# EAGLE design Venti rev1 (EAGLE 7.2.0)
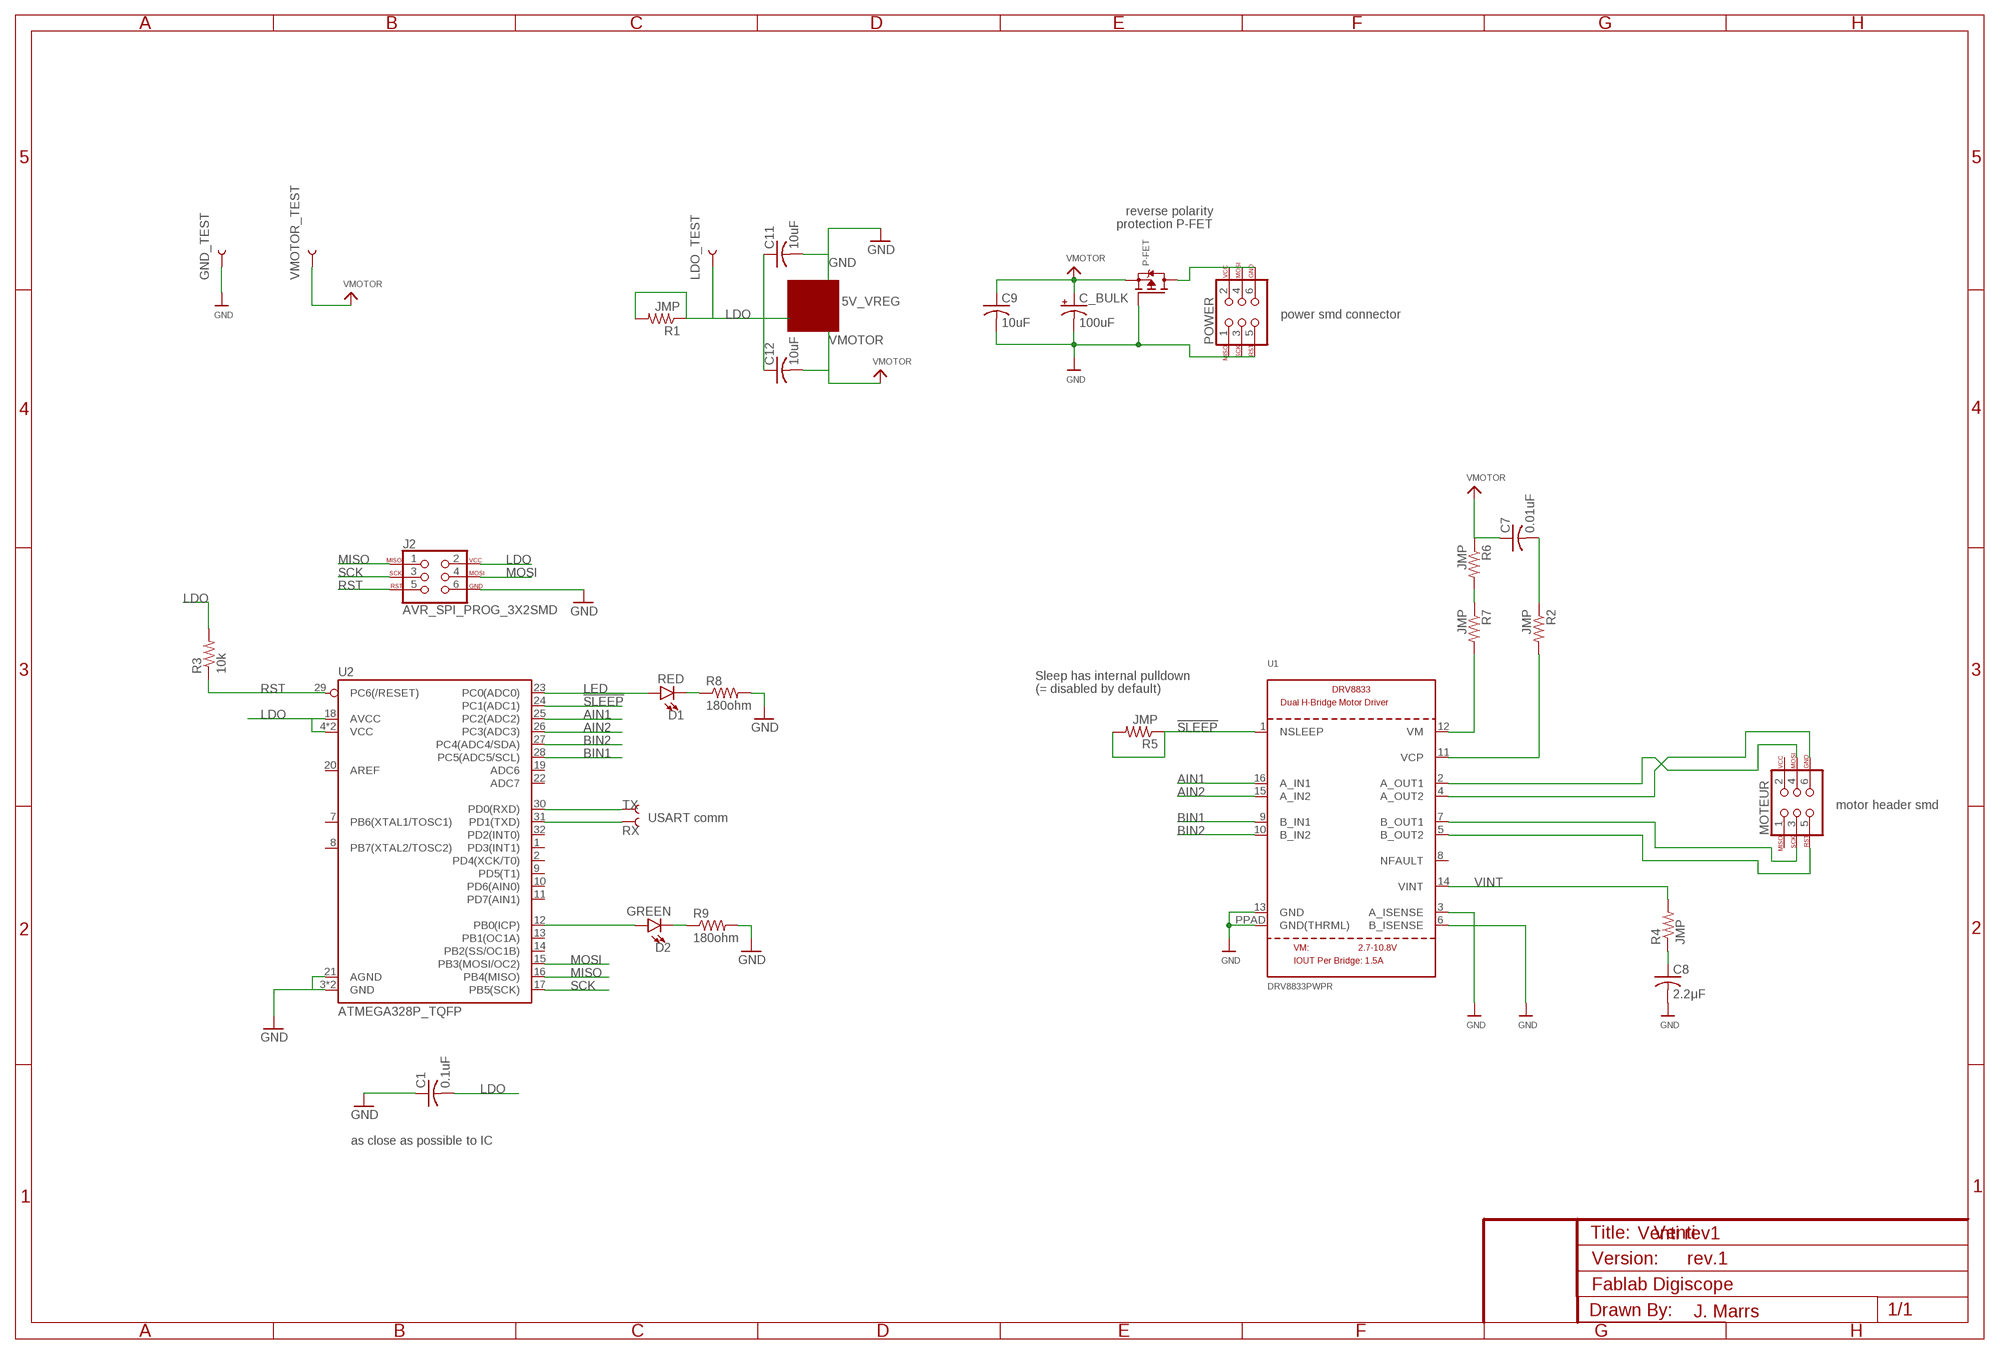
[diagram p0: schematic, sheet 1]

## Parts
5V_VREG  MOSFET_PCH-DMG2305UX-7  [SOT23-3]
C1  0.1uF  C-USC1206  [C1206]
C7  0.01uF  C-USC1206  [C1206]
C8  2.2μF  C-USC1206  [C1206]
C9  10uF  C-USC1206  [C1206]
C11  10uF  C-USC1206  [C1206]
C12  10uF  C-USC1206  [C1206]
C_BULK  100uF  100UF-POLAR-RADIAL-2.5MM-25V-20%  [CPOL-RADIAL-2.5MM-6.5MM]
D1  RED  LED-RED1206  [LED-1206]
D2  GREEN  LED-RED1206  [LED-1206]
GND_TEST  TEST-POINT3  [PAD.03X.03]
J2  AVR_SPI_PROG_3X2SMD  [2X3_SMT_POSTS]
LDO_TEST  TEST-POINT3  [PAD.03X.03]
MOTEUR  AVR_SPI_PROG_3X2SMD  [2X3_SMT_POSTS]
P-FET  MOSFET-PWIDE  [SOT23-WIDE]
POWER  AVR_SPI_PROG_3X2SMD  [2X3_SMT_POSTS]
R1  JMP  R-US_R1206  [R1206]
R2  JMP  R-US_R1206  [R1206]
R3  10k  R-US_R1206  [R1206]
R4  JMP  R-US_R1206  [R1206]
R5  JMP  R-US_R1206  [R1206]
R6  JMP  R-US_R1206  [R1206]
R7  JMP  R-US_R1206  [R1206]
R8  180ohm  R-US_R1206  [R1206]
R9  180ohm  R-US_R1206  [R1206]
RX  TEST-POINT3  [PAD.03X.03]
TX  TEST-POINT3  [PAD.03X.03]
U1  DRV8833PWPR  DRV8833  [HTSSOP16]
U2  ATMEGA328P_TQFP  [TQFP32-08]
VMOTOR_TEST  TEST-POINT3  [PAD.03X.03]

## Nets
!SLEEP: R5.1 R5.2 U1.1(NSLEEP) U2.24(PC1(ADC1))
AIN1: U1.16(A_IN1) U2.25(PC2(ADC2))
AIN2: U1.15(A_IN2) U2.26(PC3(ADC3))
AOUT1: MOTEUR.4 U1.2(A_OUT1)
AOUT2: MOTEUR.6 U1.4(A_OUT2)
BIN1: U1.9(B_IN1) U2.28(PC5(ADC5/SCL))
BIN2: U1.10(B_IN2) U2.27(PC4(ADC4/SDA))
BOUT1: MOTEUR.3 U1.7(B_OUT1)
BOUT2: MOTEUR.5 U1.5(B_OUT2)
GND: 5V_VREG.3(D) C1.1 C8.2 C9.2 C11.2 C_BULK.2(-) GND_TEST.P$1 J2.6 P-FET.1(G) POWER.1 POWER.3 POWER.5 R8.2 R9.2 U1.3(A_ISENSE) U1.6(B_ISENSE) U1.13(GND) U1.PPAD(GND(THRML)) U2.3(GND) U2.5(GND) U2.21(AGND)
LDO: 5V_VREG.1(G) C1.2 C11.1 C12.1 J2.2 LDO_TEST.P$1 R1.1 R1.2 R3.2 U2.4(VCC) U2.6(VCC) U2.18(AVCC)
LED: D1.A U2.23(PC0(ADC0))
MISO: J2.1 U2.16(PB4(MISO))
MOSI: J2.4 U2.15(PB3(MOSI/OC2))
N$1: C8.1 R4.1
N$2: C7.2 R2.1
N$4: R7.2 U1.12(VM)
N$5: R6.2 R7.1
N$6: TX.P$1 U2.30(PD0(RXD))
N$7: RX.P$1 U2.31(PD1(TXD))
N$8: R2.2 U1.11(VCP)
N$9: D2.A U2.12(PB0(ICP))
N$10: D1.C R8.1
N$11: D2.C R9.1
PWRIN: P-FET.3(D) POWER.2 POWER.4 POWER.6
RST: J2.5 R3.1 U2.29(PC6(/RESET))
SCK: J2.3 U2.17(PB5(SCK))
VINT: R4.2 U1.14(VINT)
VMOTOR: 5V_VREG.2(S) C7.1 C9.1 C12.2 C_BULK.1(+) P-FET.2(S) R6.1 VMOTOR_TEST.P$1
Unconnected: MOTEUR.1 MOTEUR.2 U1.8(NFAULT) U2.1(PD3(INT1)) U2.2(PD4(XCK/T0)) U2.7(PB6(XTAL1/TOSC1)) U2.8(PB7(XTAL2/TOSC2)) U2.9(PD5(T1)) U2.10(PD6(AIN0)) U2.11(PD7(AIN1)) U2.13(PB1(OC1A)) U2.14(PB2(SS/OC1B)) U2.19(ADC6) U2.20(AREF) U2.22(ADC7) U2.32(PD2(INT0))

## Notes on the sheet
- reverse polarity
- protection P-FET
- power smd connector
- Sleep has internal pulldown
- (= disabled by default)
- motor header smd
- USART comm
- as close as possible to IC
- Venti
- rev.1
- Fablab Digiscope
- J. Marrs

## Library data of the parts
5V_VREG = SparkFun-DiscreteSemi:MOSFET_PCH: P-channel MOSFETs Voltage controlled devices that allow control of high current outputs. SparkFun Products: SparkFun ESP32 Thing <https://www.sparkfun.com/products/13907> SparkFun ESP8266 Thing <https://www.sparkfun.com/products/13231> SparkFun Pi Servo HAT V2 <https://www.sparkfun.com/products/15316> DMG2305UX-7 (20V/4.2A/SOT23-3); PROD_ID: TRAN-14388; VALUE: 20V/4.2A/52mΩ/1.4W
C1 C7-C9 C11 C12 = adafruit:C-US: CAPACITOR, American symbol
C_BULK = SparkFun-Capacitors:100UF-POLAR: 100µF polarized capacitors A capacitor is a passive two-terminal electrical component used to store electrical energy temporarily in an electric field.; PROD_ID: CAP-08439
D1 = SparkFun-LED:LED-RED: Red SMD LED Used in manufacturing of most products at SparkFun Packages: 0603 - SMD 0603 package [Product Link] <http://docs.avagotech.com/docs/AV02-0551EN> 0603 SMART - SMD 0603 SMART package ( more efficient and expensive)[Product Link] <http://www.osram-os.com/Graphics/XPic2/00077099_0.pdf> 1206 - SMD1206 package [Product Link] <https://www.sparkfun.com/datasheets/DevTools/LilyPad/Q150OVS4.pdff> SparkFun Products: Pro Mini 328 -5V <https://www.sparkfun.com/products/821> RedBoard <https://www.sparkfun.com/products/12757> IOIO-OTG <https://www.sparkfun.com/products/13613>; PROD_ID: DIO-09912
D2 = SparkFun-LED:LED-RED: Red SMD LED Used in manufacturing of most products at SparkFun Packages: 0603 - SMD 0603 package [Product Link] <http://docs.avagotech.com/docs/AV02-0551EN> 0603 SMART - SMD 0603 SMART package ( more efficient and expensive)[Product Link] <http://www.osram-os.com/Graphics/XPic2/00077099_0.pdf> 1206 - SMD1206 package [Product Link] <https://www.sparkfun.com/datasheets/DevTools/LilyPad/Q150OVS4.pdff> SparkFun Products: Pro Mini 328 -5V <https://www.sparkfun.com/products/821> RedBoard <https://www.sparkfun.com/products/12757> IOIO-OTG <https://www.sparkfun.com/products/13613>; PROD_ID: DIO-09912; VALUE: RED
GND_TEST LDO_TEST RX TX VMOTOR_TEST = SparkFun-Connectors:TEST-POINT: SparkFun Test Points Bare copper test points for troubleshooting or In-Circuit-Testing. These are used by our Production team for verifying production board runs using pogo-pins on test beds. SparkFun Products: SparkFun LSM9DS1 Breakout <https://www.sparkfun.com/products/13284> SparkFun PSOC <https://www.sparkfun.com/products/13714> SparkFun Load Cell Amplifier <https://www.sparkfun.com/products/13879>
J2 MOTEUR POWER = SparkFun-Connectors:AVR_SPI_PROG_3X2: AVR ISP 6 Pin This is the reduced ISP connector for AVR programming. Common on Arduino. This footprint will take up less PCB space and can be used with a 10-pin to 6-pin adapter such as SKU: BOB-08508 **Special note about "TEST_POINT" package. The stop mask is on the top side, so if you want your programming test points to be on the bottom of your board, make sure to place this package on the bottom side of the board. This also ensure that the orientation to program from the bottom side will be correct. SparkFun Products: SparkFun ISP Pogo Adapter <https://www.sparkfun.com/products/11591> - NS Tiny AVR Programmer <https://www.sparkfun.com/products/11801> -PTH
P-FET = microbuilder:MOSFET-P: P-Channel Mosfet LEGEND VDS: Voltage Drain-Source ID: Drain Current RDS(ON): Drain-Source On-State Resistance VGS(TH): Gate-Source Threshold Voltage CISS: Drain-Source Input Capacitance SOT-23 Name VDS ID RDS(ON) VGS(TH) CISS Order Number IRLML5103 30V 760mA 600 mOhm -- 75pF @ 25V Digikey: IRLML5103PBFCT-ND IRLML6401 12V 4.3A 50 mOhm 950mV @ 250µA 830pF @ 10V Digikey: IRLML6401PBFTR-ND NTR0202PL 20V 400mA 800 mOhm 2.3V @ 250uA 70pF @ 5V Digikey: NTR0202PLT1GOSTR-ND NTR4101PT1G 20V 1.8A 85 mOhm 1.2V @ 250uA 675pF @ 10V Digikey: NTR4101PT1GOSCT-ND DMP2004K 20V 600mA 900 mOhm 1V @ 250uA 175pF @ 16V Digikey: DMP2004KDICT-ND PMV65XP 20V 3.9A 76 mOhm 950mV @ 1mA 725pF @ 20V Digikey: 568-2358-2-ND TO-252 Name VDS ID RDS(ON) VGS(TH) CISS Order Number AOD417 30V 25A 34 mOhm 3V @ 250µA 920pF @ 15V Digikey: 785-1106-2-ND
R1-R9 = adafruit:R-US_: RESISTOR, American symbol
U1 = microbuilder:DRV8833: DRV8833 Dual H-Bridge Motor Driver -- HTSSOP Package
U2 = SparkFun-IC-Microcontroller:ATMEGA328P_TQFP: Popular 328P in QFP Storefront component: ATmega328 - TQFP <https://www.sparkfun.com/products/13448> (COM-13448) Datasheet <http://www.sparkfun.com/datasheets/Components/SMD/ATMega328.pdf> SparkFun Products SparkFun RedBoard - Programmed with Arduino <https://www.sparkfun.com/products/12757> (DEV-12757) Arduino Pro Mini 328 - 5V/16MHz <https://www.sparkfun.com/products/11113> (DEV-11113) Arduino Pro Mini 328 - 3.3V/8MHz <https://www.sparkfun.com/products/11114> (DEV-11114) SparkFun OpenLog <https://www.sparkfun.com/products/13712> (DEV-13712) SparkFun MicroView - OLED Arduino Module <https://www.sparkfun.com/products/12923> (DEV-12923) SparkFun Digital Sandbox <https://www.sparkfun.com/products/12651> (DEV-12651) SparkFun PicoBoard <https://www.sparkfun.com/products/11888> (WIG-11888) Arduino Fio <https://www.sparkfun.com/products/10116> (DEV-10116) LilyPad Arduino 328 Main Board <https://www.sparkfun.com/products/13342> (DEV-13342) SparkFun RedStick <https://www.sparkfun.com/products/13741> (DEV-13741) LilyPad MP3 <https://www.sparkfun.com/products/11013> (DEV-11013) LilyPad Arduino SimpleSnap <https://www.sparkfun.com/products/10941> (DEV-10941) SparkFun Stepoko <https://www.sparkfun.com/products/13899> (ROB-13899) SparkFun Geiger Counter <https://www.sparkfun.com/products/11345> (SEN-11345) SparkFun EL Sequencer <https://www.sparkfun.com/products/12781> (COM-12781) Arduino Pro 328 - 5V/16MHz <https://www.sparkfun.com/products/10915> (DEV-10915) CryptoCape <https://www.sparkfun.com/products/12773> (DEV-12773) SparkFun IR Thermometer Evaluation Board - MLX90614 <https://www.sparkfun.com/products/10740> (SEN-10740) SparkFun RedBot Mainboard <https://www.sparkfun.com/products/12097> (ROB-12097) Arduino Pro 328 - 3.3V/8MHz <https://www.sparkfun.com/products/10914> (DEV-10914) SparkFun Block for Intel® Edison - Arduino <https://www.sparkfun.com/products/13036> (DEV-13036) SparkFun Simon Says - Surface Mount Soldering Kit <https://www.sparkfun.com/products/10935> (KIT-10935) SparkFun 7-Segment Serial Display - Red <https://www.sparkfun.com/products/11441> (COM-11441) SparkFun 7-Segment Serial Display - White <https://www.sparkfun.com/products/11629> (COM-11629) SparkFun 7-Segment Serial Display - Yellow <https://www.sparkfun.com/products/11443> (COM-11443) SparkFun 7-Segment Serial Display - Kelly Green <https://www.sparkfun.com/products/11440> (COM-11440) SparkFun 7-Segment Serial Display - Blue <https://www.sparkfun.com/products/11442> (COM-11442) SparkFun OpenSegment Serial Display - 20mm (Blue) <https://www.sparkfun.com/products/11647> (COM-11647) SparkFun OpenSegment Serial Display - 20mm (Green) <https://www.sparkfun.com/products/11646> (COM-11646) SparkFun OpenSegment Serial Display - 20mm (White) <https://www.sparkfun.com/products/11648> (COM-11648) SparkFun OpenSegment Serial Display - 20mm (Red) <https://www.sparkfun.com/products/11644> (COM-11644) SparkFun OpenSegment Serial Display - 20mm (Yellow) <https://www.sparkfun.com/products/11645> (COM-11645) SparkFun OpenSegment Shield <https://www.sparkfun.com/products/13190> (DEV-13190); PROD_ID: IC-09069

## Board
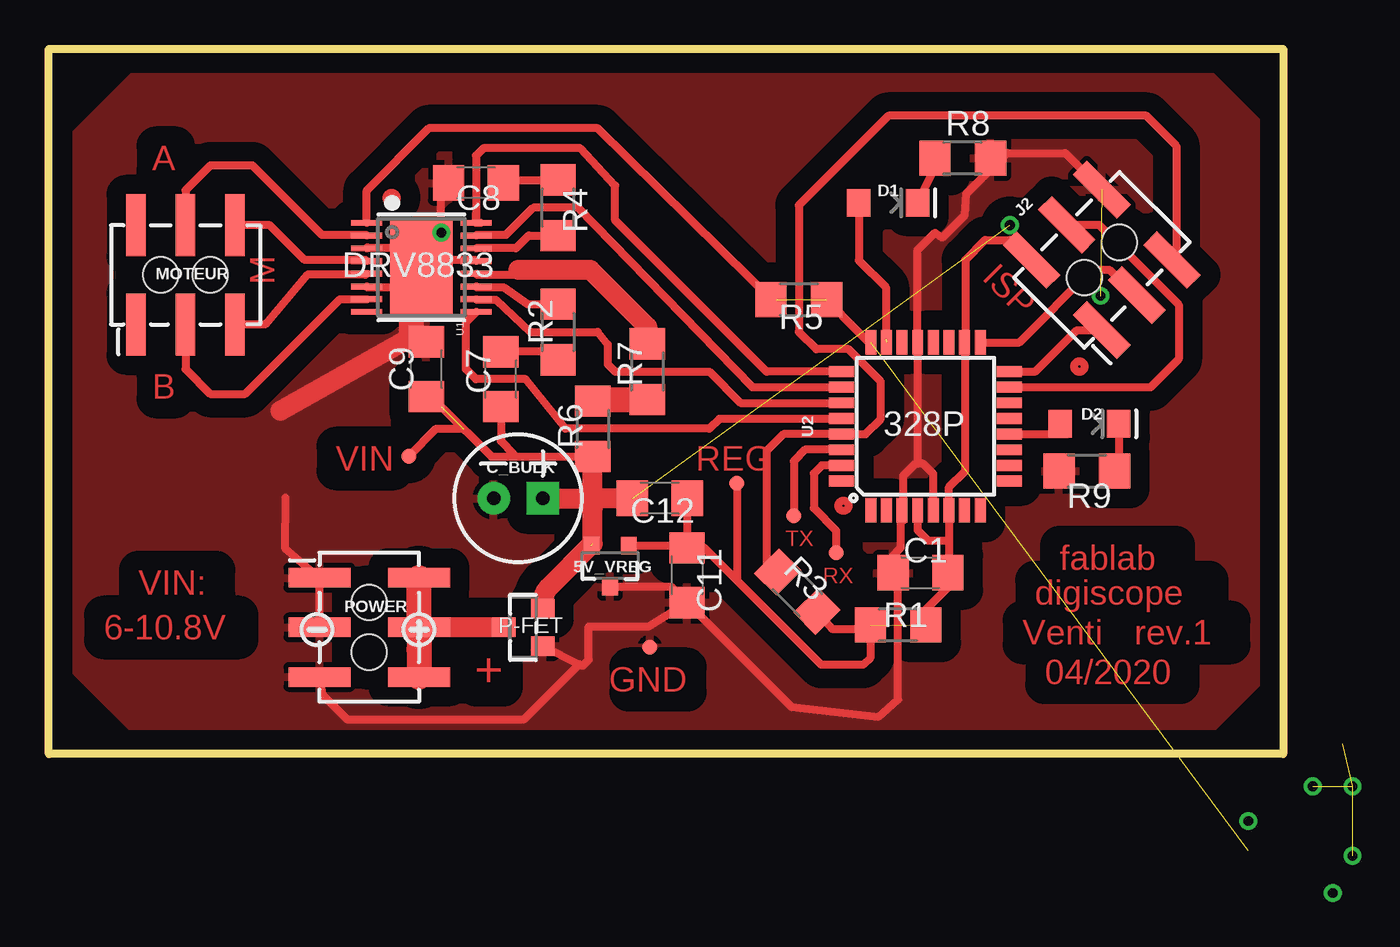
[diagram p1: board, top side]
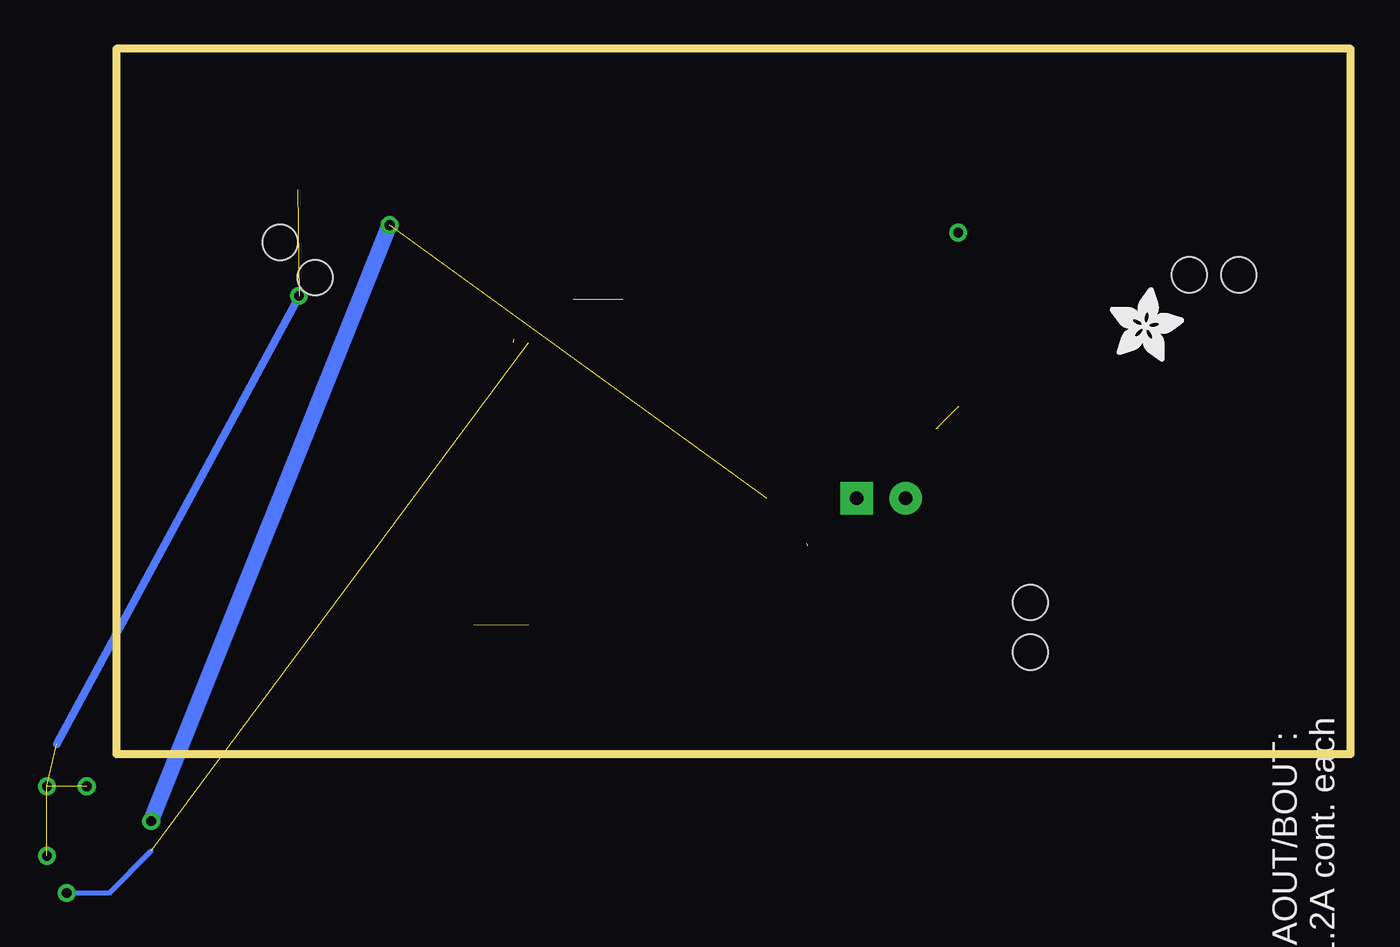
[diagram p2: board, bottom side, seen from below]

Size 63.12 x 36.07 mm. Coordinates in mm from the lower left corner, seen from the top.
Outline: 0,36.07 63.12,36.07 63.12,0 0,0 0,36.07
Copper layers (1*16): Top 0.035mm / dielectric 1.5mm / Bottom 0.035mm
Design rules "adafruit *": minimum track width 1mm, minimum drill 1mm, track to track 1mm, track to pad 1mm, pad to pad 1mm, via to via 1mm, smd to smd 1mm, copper to edge 1mm, drill to drill 1mm, minimum pad ring 10mil, minimum via ring 8mil, stop-mask expansion 2mil, vias tented up to drill 20mil, thermal gap 10mil

### Footprints (pad centres in the part's own frame; a part is rotated, then mirrored left to right if it is on the bottom)
SOT23-3 = smd 0.8 x 0.9: 1 -0.95,-1; 2 0.95,-1; 3 0,1.1
C1206 = smd 1.6 x 1.8: 1 -1.4,0; 2 1.4,0
CPOL-RADIAL-2.5MM-6.5MM = drill 0.7 pad 1.651 square: 1 1.25,0 | drill 0.7 pad 1.651: 2 -1.25,0
LED-1206 = smd 1.2 x 1.4: A -1.5,0; C 1.5,0
PAD.03X.03 = smd 0.762 x 0.762: P$1 0,0
2X3_SMT_POSTS = smd 1 x 3.17: 1 -2.54,-2.54; 2 -2.54,2.54; 3 0,-2.54; 4 0,2.54; 5 2.54,-2.54; 6 2.54,2.54 | hole 1.8: -1.27,0; 1.27,0
SOT23-WIDE = smd 1 x 1.2: 1 -0.95,-1; 2 0.95,-1; 3 0,1
R1206 = smd 1.6 x 1.803: 1 -1.422,0; 2 1.422,0
HTSSOP16 = smd 0.3 x 1.6: 1 -2.275,-2.8; 2 -1.625,-2.8; 3 -0.975,-2.8; 4 -0.325,-2.8; 5 0.325,-2.8; 6 0.975,-2.8; 7 1.625,-2.8; 8 2.275,-2.8; 9 2.275,2.8; 10 1.625,2.8; 11 0.975,2.8; 12 0.325,2.8; 13 -0.325,2.8; 14 -0.975,2.8; 15 -1.625,2.8; 16 -2.275,2.8 | smd 4.8 x 3.2: PPAD 0,0
TQFP32-08 = smd 1.27 x 0.559: 1 -4.293,2.8; 2 -4.293,2; 3 -4.293,1.2; 4 -4.293,0.4; 5 -4.293,-0.4; 6 -4.293,-1.2; 7 -4.293,-2; 8 -4.293,-2.8; 17 4.293,-2.8; 18 4.293,-2; 19 4.293,-1.2; 20 4.293,-0.4; 21 4.293,0.4; 22 4.293,1.2; 23 4.293,2; 24 4.293,2.8 | smd 0.559 x 1.27: 9 -2.8,-4.293; 10 -2,-4.293; 11 -1.2,-4.293; 12 -0.4,-4.293; 13 0.4,-4.293; 14 1.2,-4.293; 15 2,-4.293; 16 2.8,-4.293; 25 2.8,4.293; 26 2,4.293; 27 1.2,4.293; 28 0.4,4.293; 29 -0.4,4.293; 30 -1.2,4.293; 31 -2,4.293; 32 -2.8,4.293

### Placement (x,y rotation side)
5V_VREG  28.7,9.65 180 top
C1  44.58,9.27 0 top
C7  23.11,19.18 90 top
C8  21.84,29.21 180 top
C9  19.3,19.69 90 top
C11  32.64,9.14 270 top
C12  31.24,13.08 180 top
C_BULK  24,13.08 0 top
D1  42.93,28.19 0 top
D2  53.21,16.89 0 top
GND_TEST  30.73,5.46 0 top
J2  53.85,25.27 45 top
LDO_TEST  35.18,13.84 0 top
MOTEUR  6.98,24.51 0 top
P-FET  24.26,6.48 90 top
POWER  16.38,6.48 270 top
R1  43.43,6.6 0 top
R2  26.03,21.59 90 top
R3  38.28,8.31 315 top
R4  26.03,27.94 270 top
R5  38.35,23.24 180 top
R6  27.81,16.64 90 top
R7  30.61,19.56 90 top
R8  46.74,30.48 0 top
R9  53.09,14.48 180 top
RX  40.26,10.29 0 top
TX  38.1,12.19 0 top
U1  19.05,24.89 270 top
U2  44.83,16.76 90 top
U$15  [SYMBOL_PLUS]  18.92,6.35 0 top
U$16  [SYMBOL_MINUS]  13.72,6.35 0 top
U$17  [ADAFRUIT_3.5MM]  12.32,20.07 0 bottom
VMOTOR_TEST  18.41,15.24 0 top

### Tracks (layer width: path | path; a pad name or v marks a point on that pad's centre or on a via)
!SLEEP  (via drill 0.5)  (2 unrouted)
  Top 0.406: U2.24 41.94,21.06 41.02,21.97 40.13,22.88 R5.1 | 36.96,23.24 37.21,23.24 | U1.1 16.25,28.82 19.43,32 28.07,32 35.94,24.26 36.96,23.24 | 36.96,23.24 R5.2
  Bottom 0.254: v65.66,-7.11 63.5,-7.11 61.34,-4.95
AIN1
  Top 0.406: U2.25 36.7,19.56 28.96,27.3 28.96,29.08 27.18,30.99 22.23,30.99 21.84,30.61 21.84,27.18 21.85,27.68 U1.16 22.09,27.17
AIN2
  Top 0.406: U2.26 35.97,18.76 27.05,27.94 24.77,27.94 23.37,26.54 21.88,26.54 U1.15
AOUT1
  Top 0.406: U1.2 16.22,26.54 13.97,26.54 10.41,30.1 8.25,30.1 6.98,28.83 MOTEUR.4
AOUT2
  Top 0.406: U1.4 16.19,25.27 13.08,25.27 11.3,27.05 MOTEUR.6
BIN1
  Top 0.406: U1.9 21.34,22.1 21.34,19.69 21.84,19.18 24.38,19.18 26.42,16.64 33.78,16.64 34.29,17.15 40.52,17.15 U2.28
BIN2
  Top 0.406: U1.10 21.88,23.24 22.86,23.24 24.64,21.59 28.07,21.59 28.58,20.95 28.58,19.94 28.96,19.56 33.78,19.56 35.38,17.96 U2.27 40.47,18.03
BOUT1
  Top 0.406: MOTEUR.3 6.98,19.69 8.25,18.41 10.03,18.41 14.89,23.27 U1.7
BOUT2
  Top 0.406: U1.5 16.19,24.51 13.21,24.51 11.05,21.97 MOTEUR.5
GND  (via drill 0.5)  (4 unrouted)
  Top 0.406: U2.5 45.23,14.33 44.7,14.86 44.45,14.86 | 44.45,14.86 44.32,14.86 43.69,14.22 43.69,12.53 | 43.69,12.53 U2.3 | 44.45,14.86 44.43,14.88 U2.21 44.43,25.78 45.31,26.66 45.7,26.42 46.84,27.56 46.91,28.65 49,30.73 51.98,30.73 J2.6 | 43.69,12.53 43.69,11.94 43.56,11.81 43.56,10.54 43.05,10.03 43.05,9.39 C1.1 43.31,9.27 43.43,8.76 43.43,2.79 42.42,1.91 37.98,2.41 C11.2 | v20.07,26.67 20.07,28.45 20.7,29.08 | U1.6 16.29,23.88 18.16,23.88 18.54,24.26 U1.PPAD | U1.3 16.29,25.91 18.92,25.91 19.05,25.78 U1.PPAD | U1.13 21.79,25.27 19.43,25.27 U1.PPAD | C11.2 31.83,8.55 5V_VREG.3 | P-FET.1 27.13,4.59 | 27.13,4.59 27.29,4.51 27.61,4.83 27.61,6.52 30.66,6.52 C11.2 | C9.2 18.54,21.34 | POWER.3 POWER.1 12.07,10.54 12.09,13.1 | POWER.5 13.97,3.05 15.24,1.78 24.31,1.78 27.13,4.59
  Top 1.016: 11.83,17.55 18.54,21.34
  Top 1.27: 18.54,21.34 18.54,24.26
  Bottom 0.406: v53.78,23.43 66.17,0.51
  other vias: 64.64,-1.65 66.67,-5.21 66.67,-1.65
  pour Top: 4.32,34.67 0.89,31.24 0.89,4.7 1.14,4.45 4.83,0.76 58.93,0.76 62.36,4.19 62.36,31.75 59.06,35.05 4.7,35.05
LDO  (1 unrouted)
  Top 0.406: J2.2 49.49,26.04 49.4,26.04 49.15,26.29 47.88,26.29 46.86,25.27 46.86,21.09 U2.18 46.86,21.02 46.86,14.48 46.03,13.65 U2.6 46.03,10.92 | C11.1 32.53,10.65 5V_VREG.1 | 35.18,8.89 39.5,4.57 41.66,4.57 42.04,4.95 42.04,6.58 R1.1 41.82,6.41 40.05,6.41 R3.2 | 35.18,8.89 33.52,10.54 C11.1 | 46.03,10.92 46.03,9.32 C1.2 45.97,8.51 44.86,7.39 R1.2 | U2.4 44.43,11.45 44.96,10.92 46.03,10.92 | LDO_TEST.P$1 35.18,8.89 | C12.1 C11.1
LED  (1 unrouted)
  Top 0.406: 42.8,21.23 42.8,23.88 41.43,25.25 D1.A
MISO
  Top 0.406: U2.16 50.46,19.56 52.58,21.68 J2.1
MOSI
  Top 0.406: J2.4 53.7,27.07 57.78,22.99 57.78,20.19 56.36,18.76 U2.15
N$1
  Top 0.406: 23.35,28.73 C8.1 23.22,29.11 23.47,29.36 R4.1 25.81,29.08
N$2
  Top 0.406: R2.1 26.06,20.57 C7.2
N$4
  Top 0.406: U1.12 21.91,24.51 24.38,24.51 24,24.77 | 30.61,21.46 R7.2
  Top 1.016: 24,24.77 27.69,24.77 30.61,21.84 R7.2
N$5
  Top 0.406: R6.2 28.14,18.14
  Top 1.27: 28.14,18.14 R7.1
N$6
  Top 0.406: U2.30 38.68,15.56 38.1,14.99 TX.P$1
N$7
  Top 0.406: U2.31 39.53,14.76 39.12,14.35 39.12,12.57 40.26,11.43 RX.P$1
N$8
  Top 0.406: U1.11 21.89,23.88 23.24,23.88 24.49,23.01 R2.2
N$9
  Top 0.406: U2.12 52.08,16.36 D2.A
N$10
  Top 0.406: D1.C 45.57,30.48 R8.1
N$11
  Top 0.406: D2.C 54.71,14.68 R9.1
PWRIN
  Top 0.406: 22.73,6.48 P-FET.3 | 18.8,6.48 18.92,5.33
  Top 1.016: 22.73,6.48 18.8,6.48
  Top 1.27: POWER.6 18.92,5.33 POWER.4 POWER.2
RST
  Top 0.406: J2.5 57.66,25.49 57.66,31.12 56.13,32.64 42.93,32.64 38.35,28.07 38.35,21.59 39.24,20.7 40.89,20.7 42.55,19.05 42.55,17.15 41.76,16.36 U2.29 37.57,16.36 36.7,15.49 36.7,9.65 37.06,9.65 R3.1
SCK
  Top 0.406: U2.17 49.63,21.06 53.34,24.77 54.23,24.77 55.12,23.88 55.24,23.88 J2.3
VINT
  Top 0.406: U1.14 23.89,25.87 24.54,26.52 R4.2
VMOTOR  (via drill 0.5)  (4 unrouted)
  Top 0.406: 27.79,15.24 R6.1 23.75,15.21 | 19.3,17.78 C9.1 20.07,17.78 22.63,15.21 23.75,15.21 | VMOTOR_TEST.P$1 19.81,16.64 21.08,16.64 | C7.1 23.11,16 23.75,15.37 23.75,15.21
  Top 1.016: 27.81,12.57 27.81,10.76 25.55,8.5 arc45 25.26,7.79 P-FET.2 | 27.81,12.57 27.81,15.11 arc-90 27.69,15.24 | C12.2 28.32,13.08 | 28.32,13.08 arc90 27.81,12.57 | C_BULK.1 28.32,13.08
  Top 1.27: 27.79,15.24 27.69,15.24
  Bottom 0.813: v61.34,-3.43 v49.15,27.05
(copper drawn outside any net)
  shapes: Top circle x3

### Text on the board
Top: A | ISP | M | B | VIN | REG | TX | RX | fablab | VIN: | digiscope | 6-10.8V | + | Venti | rev.1 | GND | 04/2020
tPlace: DRV8833 | 328P
bPlace: PWRIN/VMOTOR: / 2.8 - 10V DC | AOUT/BOUT: / 1.2A cont. each | BSn | ASen